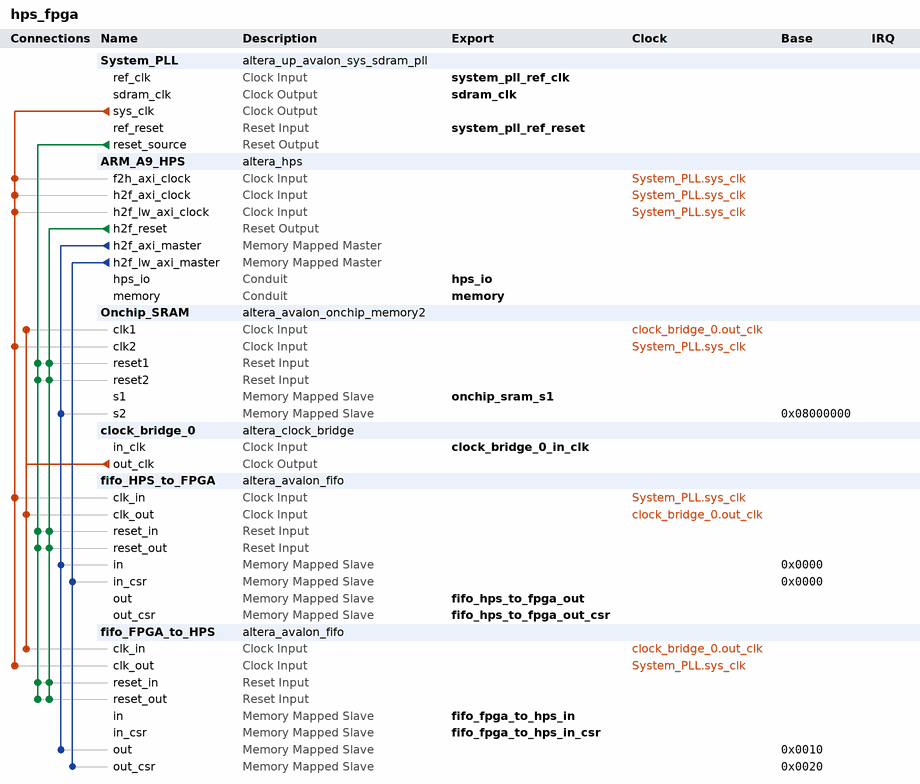
[diagram p0: system contents]
# Platform Designer (Qsys) system hps_fpga, Cyclone V 5CSEMA5F31C6
# Parameters at their usual value, and those the tool derives, are not listed.
package require -exact qsys 18.0
create_system hps_fpga
set_project_property DEVICE_FAMILY {Cyclone V}
set_project_property DEVICE 5CSEMA5F31C6

add_instance System_PLL altera_up_avalon_sys_sdram_pll 18.0
set_instance_parameter_value System_PLL CV_boards DE1-SoC
set_instance_parameter_value System_PLL gui_outclk 100.0
set_instance_parameter_value System_PLL gui_refclk 50.0

add_instance ARM_A9_HPS altera_hps 18.0
set_instance_parameter_value ARM_A9_HPS EMAC1_Mode RGMII
set_instance_parameter_value ARM_A9_HPS EMAC1_PinMuxing {HPS I/O Set 0}
set_instance_parameter_value ARM_A9_HPS F2SCLK_COLDRST_Enable false
set_instance_parameter_value ARM_A9_HPS F2SCLK_DBGRST_Enable false
set_instance_parameter_value ARM_A9_HPS F2SCLK_WARMRST_Enable false
set_instance_parameter_value ARM_A9_HPS F2SINTERRUPT_Enable true
set_instance_parameter_value ARM_A9_HPS F2S_Width 2
set_instance_parameter_value ARM_A9_HPS FPGA_PERIPHERAL_OUTPUT_CLOCK_FREQ_EMAC0_GTX_CLK 125
set_instance_parameter_value ARM_A9_HPS FPGA_PERIPHERAL_OUTPUT_CLOCK_FREQ_EMAC0_MD_CLK 100.0
set_instance_parameter_value ARM_A9_HPS FPGA_PERIPHERAL_OUTPUT_CLOCK_FREQ_EMAC1_GTX_CLK 125
set_instance_parameter_value ARM_A9_HPS FPGA_PERIPHERAL_OUTPUT_CLOCK_FREQ_EMAC1_MD_CLK 100.0
set_instance_parameter_value ARM_A9_HPS HPS_PROTOCOL DDR3
set_instance_parameter_value ARM_A9_HPS I2C0_Mode I2C
set_instance_parameter_value ARM_A9_HPS I2C0_PinMuxing {HPS I/O Set 0}
set_instance_parameter_value ARM_A9_HPS I2C1_Mode I2C
set_instance_parameter_value ARM_A9_HPS I2C1_PinMuxing {HPS I/O Set 0}
set_instance_parameter_value ARM_A9_HPS LWH2F_Enable true
set_instance_parameter_value ARM_A9_HPS MEM_BANKADDR_WIDTH 3
set_instance_parameter_value ARM_A9_HPS MEM_CLK_FREQ 400.0
set_instance_parameter_value ARM_A9_HPS MEM_COL_ADDR_WIDTH 10
set_instance_parameter_value ARM_A9_HPS MEM_DQ_WIDTH 32
set_instance_parameter_value ARM_A9_HPS MEM_DRV_STR RZQ/7
set_instance_parameter_value ARM_A9_HPS MEM_ROW_ADDR_WIDTH 15
set_instance_parameter_value ARM_A9_HPS MEM_RTT_NOM RZQ/4
set_instance_parameter_value ARM_A9_HPS MEM_RTT_WR RZQ/4
set_instance_parameter_value ARM_A9_HPS MEM_TCL 11
set_instance_parameter_value ARM_A9_HPS MEM_TFAW_NS 30.0
set_instance_parameter_value ARM_A9_HPS MEM_TRAS_NS 35.0
set_instance_parameter_value ARM_A9_HPS MEM_TRCD_NS 13.75
set_instance_parameter_value ARM_A9_HPS MEM_TRFC_NS 260.0
set_instance_parameter_value ARM_A9_HPS MEM_TRP_NS 13.75
set_instance_parameter_value ARM_A9_HPS MEM_VENDOR JEDEC
set_instance_parameter_value ARM_A9_HPS MEM_WTCL 8
set_instance_parameter_value ARM_A9_HPS QSPI_Mode {1 SS}
set_instance_parameter_value ARM_A9_HPS QSPI_PinMuxing {HPS I/O Set 0}
set_instance_parameter_value ARM_A9_HPS REF_CLK_FREQ 25.0
set_instance_parameter_value ARM_A9_HPS S2FCLK_USER2CLK 5
set_instance_parameter_value ARM_A9_HPS S2F_Width 3
set_instance_parameter_value ARM_A9_HPS SDIO_Mode {4-bit Data}
set_instance_parameter_value ARM_A9_HPS SDIO_PinMuxing {HPS I/O Set 0}
set_instance_parameter_value ARM_A9_HPS SPIM1_Mode {Single Slave Select}
set_instance_parameter_value ARM_A9_HPS SPIM1_PinMuxing {HPS I/O Set 0}
set_instance_parameter_value ARM_A9_HPS STM_Enable false
set_instance_parameter_value ARM_A9_HPS TIMING_BOARD_AC_SKEW 0.03
set_instance_parameter_value ARM_A9_HPS TIMING_BOARD_AC_TO_CK_SKEW 0.0
set_instance_parameter_value ARM_A9_HPS TIMING_BOARD_DQ_TO_DQS_SKEW 0.0
set_instance_parameter_value ARM_A9_HPS TIMING_BOARD_MAX_CK_DELAY 0.03
set_instance_parameter_value ARM_A9_HPS TIMING_BOARD_MAX_DQS_DELAY 0.02
set_instance_parameter_value ARM_A9_HPS TIMING_BOARD_SKEW_BETWEEN_DQS 0.08
set_instance_parameter_value ARM_A9_HPS TIMING_BOARD_SKEW_CKDQS_DIMM_MAX 0.16
set_instance_parameter_value ARM_A9_HPS TIMING_BOARD_SKEW_CKDQS_DIMM_MIN 0.09
set_instance_parameter_value ARM_A9_HPS TIMING_BOARD_SKEW_WITHIN_DQS 0.01
set_instance_parameter_value ARM_A9_HPS TIMING_TDH 65
set_instance_parameter_value ARM_A9_HPS TIMING_TDQSCK 255
set_instance_parameter_value ARM_A9_HPS TIMING_TDQSQ 125
set_instance_parameter_value ARM_A9_HPS TIMING_TDS 30
set_instance_parameter_value ARM_A9_HPS TIMING_TIH 140
set_instance_parameter_value ARM_A9_HPS TIMING_TIS 180
set_instance_parameter_value ARM_A9_HPS TIMING_TQSH 0.4
set_instance_parameter_value ARM_A9_HPS UART0_Mode {No Flow Control}
set_instance_parameter_value ARM_A9_HPS UART0_PinMuxing {HPS I/O Set 0}
set_instance_parameter_value ARM_A9_HPS USB1_Mode SDR
set_instance_parameter_value ARM_A9_HPS USB1_PinMuxing {HPS I/O Set 0}
set_instance_parameter_value ARM_A9_HPS desired_cfg_clk_mhz 100.0
set_instance_parameter_value ARM_A9_HPS desired_qspi_clk_mhz 400.0

add_instance Onchip_SRAM altera_avalon_onchip_memory2 18.0
set_instance_parameter_value Onchip_SRAM dataWidth 32
set_instance_parameter_value Onchip_SRAM dualPort true
set_instance_parameter_value Onchip_SRAM initMemContent false
set_instance_parameter_value Onchip_SRAM initializationFileName onchip_mem.hex
set_instance_parameter_value Onchip_SRAM memorySize 1024

add_instance clock_bridge_0 altera_clock_bridge 18.0
set_instance_parameter_value clock_bridge_0 DERIVED_CLOCK_RATE 0
set_instance_parameter_value clock_bridge_0 EXPLICIT_CLOCK_RATE 50000000

add_instance fifo_HPS_to_FPGA altera_avalon_fifo 18.0
set_instance_parameter_value fifo_HPS_to_FPGA bitsPerSymbol 16
set_instance_parameter_value fifo_HPS_to_FPGA channelWidth 8
set_instance_parameter_value fifo_HPS_to_FPGA errorWidth 8
set_instance_parameter_value fifo_HPS_to_FPGA fifoDepth 256
set_instance_parameter_value fifo_HPS_to_FPGA fifoInputInterfaceOptions AVALONMM_WRITE
set_instance_parameter_value fifo_HPS_to_FPGA fifoOutputInterfaceOptions AVALONMM_READ
set_instance_parameter_value fifo_HPS_to_FPGA singleClockMode false
set_instance_parameter_value fifo_HPS_to_FPGA symbolsPerBeat 2
set_instance_parameter_value fifo_HPS_to_FPGA useBackpressure false
set_instance_parameter_value fifo_HPS_to_FPGA useIRQ false
set_instance_parameter_value fifo_HPS_to_FPGA usePacket true
set_instance_parameter_value fifo_HPS_to_FPGA useReadControl true

add_instance fifo_FPGA_to_HPS altera_avalon_fifo 18.0
set_instance_parameter_value fifo_FPGA_to_HPS bitsPerSymbol 16
set_instance_parameter_value fifo_FPGA_to_HPS channelWidth 8
set_instance_parameter_value fifo_FPGA_to_HPS errorWidth 8
set_instance_parameter_value fifo_FPGA_to_HPS fifoDepth 256
set_instance_parameter_value fifo_FPGA_to_HPS fifoInputInterfaceOptions AVALONMM_WRITE
set_instance_parameter_value fifo_FPGA_to_HPS fifoOutputInterfaceOptions AVALONMM_READ
set_instance_parameter_value fifo_FPGA_to_HPS singleClockMode false
set_instance_parameter_value fifo_FPGA_to_HPS symbolsPerBeat 2
set_instance_parameter_value fifo_FPGA_to_HPS useBackpressure false
set_instance_parameter_value fifo_FPGA_to_HPS useIRQ false
set_instance_parameter_value fifo_FPGA_to_HPS usePacket true
set_instance_parameter_value fifo_FPGA_to_HPS useReadControl true

# connections
add_connection clock_bridge_0.out_clk fifo_FPGA_to_HPS.clk_in clock
add_connection clock_bridge_0.out_clk fifo_HPS_to_FPGA.clk_out clock
add_connection clock_bridge_0.out_clk Onchip_SRAM.clk1 clock
add_connection System_PLL.sys_clk ARM_A9_HPS.f2h_axi_clock clock
add_connection System_PLL.sys_clk ARM_A9_HPS.h2f_axi_clock clock
add_connection System_PLL.sys_clk ARM_A9_HPS.h2f_lw_axi_clock clock
add_connection System_PLL.sys_clk fifo_FPGA_to_HPS.clk_out clock
add_connection System_PLL.sys_clk fifo_HPS_to_FPGA.clk_in clock
add_connection System_PLL.sys_clk Onchip_SRAM.clk2 clock
add_connection ARM_A9_HPS.h2f_reset fifo_FPGA_to_HPS.reset_in reset
add_connection ARM_A9_HPS.h2f_reset fifo_FPGA_to_HPS.reset_out reset
add_connection ARM_A9_HPS.h2f_reset fifo_HPS_to_FPGA.reset_in reset
add_connection ARM_A9_HPS.h2f_reset fifo_HPS_to_FPGA.reset_out reset
add_connection ARM_A9_HPS.h2f_reset Onchip_SRAM.reset1 reset
add_connection ARM_A9_HPS.h2f_reset Onchip_SRAM.reset2 reset
add_connection System_PLL.reset_source fifo_FPGA_to_HPS.reset_in reset
add_connection System_PLL.reset_source fifo_FPGA_to_HPS.reset_out reset
add_connection System_PLL.reset_source fifo_HPS_to_FPGA.reset_in reset
add_connection System_PLL.reset_source fifo_HPS_to_FPGA.reset_out reset
add_connection System_PLL.reset_source Onchip_SRAM.reset1 reset
add_connection System_PLL.reset_source Onchip_SRAM.reset2 reset
add_connection ARM_A9_HPS.h2f_axi_master fifo_FPGA_to_HPS.out avalon
set_connection_parameter_value ARM_A9_HPS.h2f_axi_master/fifo_FPGA_to_HPS.out baseAddress 0x0010
add_connection ARM_A9_HPS.h2f_axi_master fifo_HPS_to_FPGA.in avalon
set_connection_parameter_value ARM_A9_HPS.h2f_axi_master/fifo_HPS_to_FPGA.in baseAddress 0x0000
add_connection ARM_A9_HPS.h2f_axi_master Onchip_SRAM.s2 avalon
set_connection_parameter_value ARM_A9_HPS.h2f_axi_master/Onchip_SRAM.s2 baseAddress 0x08000000
add_connection ARM_A9_HPS.h2f_lw_axi_master fifo_FPGA_to_HPS.out_csr avalon
set_connection_parameter_value ARM_A9_HPS.h2f_lw_axi_master/fifo_FPGA_to_HPS.out_csr baseAddress 0x0020
add_connection ARM_A9_HPS.h2f_lw_axi_master fifo_HPS_to_FPGA.in_csr avalon
set_connection_parameter_value ARM_A9_HPS.h2f_lw_axi_master/fifo_HPS_to_FPGA.in_csr baseAddress 0x0000

# exported interfaces
add_interface clock_bridge_0_in_clk clock sink
set_interface_property clock_bridge_0_in_clk EXPORT_OF clock_bridge_0.in_clk
add_interface fifo_fpga_to_hps_in avalon slave
set_interface_property fifo_fpga_to_hps_in EXPORT_OF fifo_FPGA_to_HPS.in
add_interface fifo_fpga_to_hps_in_csr avalon slave
set_interface_property fifo_fpga_to_hps_in_csr EXPORT_OF fifo_FPGA_to_HPS.in_csr
add_interface fifo_hps_to_fpga_out avalon slave
set_interface_property fifo_hps_to_fpga_out EXPORT_OF fifo_HPS_to_FPGA.out
add_interface fifo_hps_to_fpga_out_csr avalon slave
set_interface_property fifo_hps_to_fpga_out_csr EXPORT_OF fifo_HPS_to_FPGA.out_csr
add_interface hps_io conduit end
set_interface_property hps_io EXPORT_OF ARM_A9_HPS.hps_io
add_interface memory conduit end
set_interface_property memory EXPORT_OF ARM_A9_HPS.memory
add_interface onchip_sram_s1 avalon slave
set_interface_property onchip_sram_s1 EXPORT_OF Onchip_SRAM.s1
add_interface sdram_clk clock source
set_interface_property sdram_clk EXPORT_OF System_PLL.sdram_clk
add_interface system_pll_ref_clk clock sink
set_interface_property system_pll_ref_clk EXPORT_OF System_PLL.ref_clk
add_interface system_pll_ref_reset reset sink
set_interface_property system_pll_ref_reset EXPORT_OF System_PLL.ref_reset

set_interconnect_requirement {$system} qsys_mm.clockCrossingAdapter HANDSHAKE
set_interconnect_requirement {$system} qsys_mm.enableEccProtection FALSE
set_interconnect_requirement {$system} qsys_mm.insertDefaultSlave FALSE
set_interconnect_requirement {$system} qsys_mm.maxAdditionalLatency 1

save_system hps_fpga.qsys
